# Altium schematic sheet PCB_RGBlimp-Q.schdoc
size 302 x 215 mm; Name: A_A4; Symbol: A_A4; Device: A_A4; @Project Name: RGBlimp-Q Control Unit; REV: 1.1; Date: 2023-12-02; Sheet: 1/1; Draw By: Hao Cheng; Company: PKU; Convert to PCB: yes; Add into BOM: yes
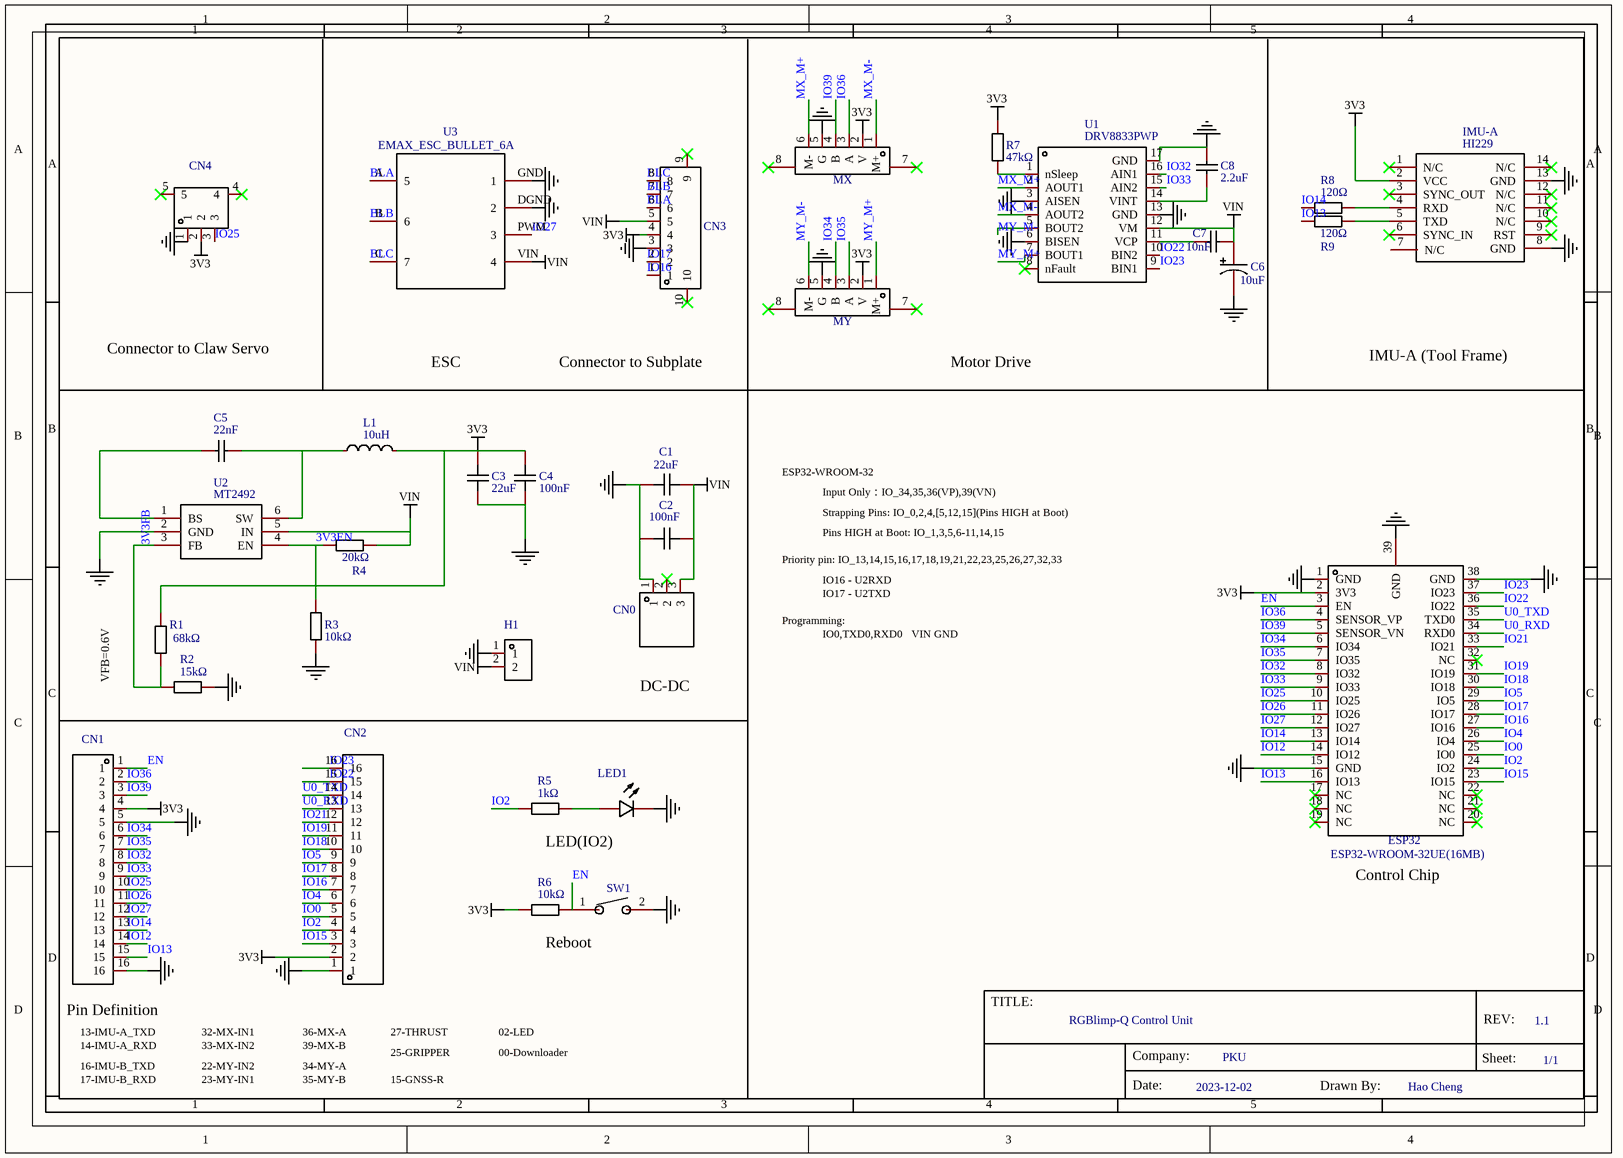
[diagram p0: PCB_RGBlimp-Q.schdoc]

## Parts
C1  22uF  [C0603]
C2  100nF  [C0603]
C3  22uF  [C0603]
C4  100nF  [C0603]
C5  22nF  [C0603]
C6  10uF  [CAP-SMD_L3.2-W1.6]
C7  10nF  [C0603]
C8  2.2uF  [C0603]
CN0  S3B-XH-A (LF)(SN)  [CONN-TH_S3B-XH-A-LF-SN-RGBLIMP]  (value not drawn)
CN1  A2005WV-16P  [HDR-TH_16P-P2.00-V-M]  (value not drawn)
CN2  A2005WV-16P  [HDR-TH_16P-P2.00-V-M]  (value not drawn)
CN3  AFC12-S08CCC-00  [CONN-SMD_8P-P1.25-V-M_AFC12-S08CCC-00]  (value not drawn)
CN4  AFC12-S03CCC-00  [CONN-SMD_AFC12-S03CCC-00]  (value not drawn)
ESP32  ESP32-WROOM-32UE(16MB)  [WIFI-SMD_ESP32-WROOM-32UE]
H1  A2005WV-2P_C2879963  [HDR-TH_2P-P2.00-V-M]  (value not drawn)
IMU-A  HI229  [HI229]
L1  10uH  [IND-SMD_L6.0-W6.0_SWPA6045S]
LED1  FC-DA1608BK-470H10  [LED0603-RD]  (value not drawn)
MX  KH-FG0.5-H2.0-6PIN  [FPC-SMD_KH-FG0.5-H2.0-6PIN]  (value not drawn)
MY  KH-FG0.5-H2.0-6PIN  [FPC-SMD_KH-FG0.5-H2.0-6PIN]  (value not drawn)
R1  68kΩ  [R0603]
R2  15kΩ  [R0603]
R3  10kΩ  [R0603]
R4  20kΩ  [R0603]
R5  1kΩ  [R0603]
R6  10kΩ  [R0603]
R7  47kΩ  [R0603]
R8  120Ω  [R0603]
R9  120Ω  [R0603]
SW1  TSA343G00D-250J2  [SW-SMD_L4.0-W2.9-P4.15-EH]  (value not drawn)
U1  DRV8833PWP  [TSSOP-16_L5.0-W4.4-P0.65-LS6.4-BL-EP]
U2  MT2492  [SOT-23-6_L2.9-W1.6-P0.95-LS2.8-BR]
U3  EMAX_ESC_BULLET_6A  [EMAX_ESC_BULLET_6A]

## Nets
3V3: C3.1 C4.1 CN1.4 CN2.2 CN3.4 CN4.2 ESP32.2(3V3) IMU-A.2(VCC) L1.2 MX.2(V) MY.2(V) R1.1 R6.1 R7.1
GND: C1.1 C2.1 C3.2 C4.2 C6.2 C8.1 CN0.1 CN1.5 CN1.16 CN2.1 CN3.3 CN4.1 ESP32.1(GND) ESP32.15(GND) ESP32.38(GND) ESP32.39(GND) H1.1 IMU-A.8(GND) IMU-A.13(GND) LED1.1(-) MX.5(G) MY.5(G) R2.2 R3.2 SW1.2 U1.3(AISEN) U1.6(BISEN) U1.13(GND) U1.17(GND) U2.2(GND) U3.DGND(2) U3.GND(1)
VIN: C1.2 C2.2 C6.1 C7.2 CN0.3 CN3.5 H1.2 R4.2 U1.12(VM) U2.5(IN) U3.VIN(4)
3V3EN: R3.1 R4.1 U2.4(EN)
3V3FB: R1.2 R2.1 U2.3(FB)
BLA: CN3.6 U3.A(5)
BLB: CN3.7 U3.B(6)
BLC: CN3.8 U3.C(7)
EN: CN1.1 ESP32.3(EN) R6.2 SW1.1
IO0: CN2.5 ESP32.25(IO0)
IO2: CN2.4 ESP32.24(IO2) R5.1
IO4: CN2.6 ESP32.26(IO4)
IO5: CN2.9 ESP32.29(IO5)
IO12: CN1.14 ESP32.14(IO12)
IO13: CN1.15 ESP32.16(IO13) R9.1
IO14: CN1.13 ESP32.13(IO14) R8.1
IO15: CN2.3 ESP32.23(IO15)
IO16: CN2.7 CN3.1 ESP32.27(IO16)
IO17: CN2.8 CN3.2 ESP32.28(IO17)
IO18: CN2.10 ESP32.30(IO18)
IO19: CN2.11 ESP32.31(IO19)
IO21: CN2.12 ESP32.33(IO21)
IO22: CN2.15 ESP32.36(IO22) U1.10(BIN2)
IO23: CN2.16 ESP32.37(IO23) U1.9(BIN1)
IO25: CN1.10 CN4.3 ESP32.10(IO25)
IO26: CN1.11 ESP32.11(IO26)
IO27: CN1.12 ESP32.12(IO27) U3.PWM(3)
IO32: CN1.8 ESP32.8(IO32) U1.16(AIN1)
IO33: CN1.9 ESP32.9(IO33) U1.15(AIN2)
IO34: CN1.6 ESP32.6(IO34) MY.4(B)
IO35: CN1.7 ESP32.7(IO35) MY.3(A)
IO36: CN1.2 ESP32.4(SENSOR_VP) MX.3(A)
IO39: CN1.3 ESP32.5(SENSOR_VN) MX.4(B)
MX_M+: MX.6(M-) U1.2(AOUT1)
MX_M-: MX.1(M+) U1.4(AOUT2)
MY_M+: MY.1(M+) U1.7(BOUT1)
MY_M-: MY.6(M-) U1.5(BOUT2)
U0_RXD: CN2.13 ESP32.34(RXD0)
U0_TXD: CN2.14 ESP32.35(TXD0)
NetC5_1: C5.1 U2.1(BS)
NetC5_2: C5.2 L1.1 U2.6(SW)
NetC7_1: C7.1 U1.11(VCP)
NetC8_2: C8.2 U1.14(VINT)
NetIMU-A_4: IMU-A.4(RXD) R8.2
NetIMU-A_5: IMU-A.5(TXD) R9.2
NetLED1_2: LED1.2(+) R5.2
NetR7_2: R7.2 U1.1(nSleep)

Not connected (* = marked no-connect by the designer): CN0 2*; CN3 9* 10*; CN4 4* 5*; ESP32 17(NC)* 18(NC)* 19(NC)* 20(NC)* 21(NC)* 22(NC)* 32(NC)*; IMU-A 1(N/C)* 3(SYNC_OUT)* 6(SYNC_IN)* 7(N/C) 9(RST)* 10(N/C)* 11(N/C)* 12(N/C)* 14(N/C)*; MX 7* 8*; MY 7* 8*; U1 8(nFault)*

## Notes on the sheet
- Connector to Claw Servo
- ESC
- Connector to Subplate
- Motor Drive
- IMU-A (Tool Frame)
- ESP32-WROOM-32
- Input Only：IO_34,35,36(VP),39(VN)
- Priority pin: IO_13,14,15,16,17,18,19,21,22,23,25,26,27,32,33
- Strapping Pins: IO_0,2,4,[5,12,15](Pins HIGH at Boot)
- Pins HIGH at Boot: IO_1,3,5,6-11,14,15
- Programming:
- IO16 - U2RXD
- IO17 - U2TXD
- IO0,TXD0,RXD0   VIN GND
- VFB=0.6V
- DC-DC
- LED(IO2)
- (near ESP32) Control Chip
- Reboot
- (near CN1) Pin Definition
- 13-IMU-A_TXD
- 32-MX-IN1
- 36-MX-A
- 27-THRUST
- 02-LED
- 14-IMU-A_RXD
- 17-IMU-B_RXD
- 16-IMU-B_TXD
- 22-MY-IN2
- 23-MY-IN1
- 33-MX-IN2
- 39-MX-B
- 35-MY-B
- 34-MY-A
- 25-GRIPPER
- 15-GNSS-R
- 00-Downloader
- 1
- 2
- 3
- 4
- 5
- A
- B
- C
- D
- TITLE:
- RGBlimp-Q Control Unit
- REV:
- 1.1
- Date:
- Company:
- 2023-12-02
- PKU
- Drawn By:
- Hao Cheng
- Sheet:
- 1/1

## Library data of the parts
C1 C3 = 22uF: Manufacturer: SAMSUNG(三星); Manufacturer Part: CL10A226MQ8NRNC; Convert to PCB: yes; Name: 22uF; Symbol: 22uF; Device: 22uF; Supplier: LCSC; Supplier Part: C59461; JLCPCB Part Class: Basic Part; link: https://so.szlcsc.com/global.html?k=C59461&amp;ref=editor; Add into BOM: yes; Origin Footprint: C0603
C2 C4 = 100nF: Manufacturer: YAGEO(国巨); Manufacturer Part: CC0603KRX7R9BB104; Convert to PCB: yes; Name: 100nF; Symbol: 100nF; Device: 100nF; Supplier: LCSC; Supplier Part: C14663; JLCPCB Part Class: Basic Part; link: https://so.szlcsc.com/global.html?k=C14663&amp;ref=editor; Add into BOM: yes; Origin Footprint: C0603
C5 = 22nF: Manufacturer: FH(风华); Manufacturer Part: 0603B223K500NT; Convert to PCB: yes; Name: 22nF; Symbol: 22nF; Device: 22nF; Supplier: LCSC; Supplier Part: C77571; JLCPCB Part Class: Extended Part; link: https://so.szlcsc.com/global.html?k=C77571&amp;ref=editor; Add into BOM: yes; Origin Footprint: C0603
C6 = 10uF: Manufacturer: TORCH(火炬); Manufacturer Part: CA45-A-16V-10μF-K; Convert to PCB: yes; Name: 10uF; Symbol: 10uF; Device: 10uF; Supplier: LCSC; Supplier Part: C185774; JLCPCB Part Class: Extended Part; Add into BOM: yes; Origin Footprint: CAP-SMD_L3.2-W1.6
C7 = 10nF: Manufacturer Part: GRM188R71H103KA01D; Manufacturer: muRata(村田); Convert to PCB: yes; Name: 10nF; Symbol: 10nF; Device: 10nF; Supplier: LCSC; Supplier Part: C77053; JLCPCB Part Class: Extended Part; link: https://so.szlcsc.com/global.html?k=C77053&amp;ref=editor; Add into BOM: yes; Origin Footprint: C0603
C8 = 2.2uF: Manufacturer Part: CL10A225KO8NNNC; Manufacturer: SAMSUNG(三星); Convert to PCB: yes; Name: 2.2uF; Symbol: 2.2uF; Device: 2.2uF; Supplier: LCSC; Supplier Part: C23630; JLCPCB Part Class: Basic Part; link: https://so.szlcsc.com/global.html?k=C23630&amp;ref=editor; Add into BOM: yes; Origin Footprint: C0603
CN0 = S3B-XH-A (LF)(SN): Manufacturer: JST; Convert to PCB: yes; Name: S3B-XH-A (LF)(SN); Symbol: S3B-XH-A (LF)(SN); Device: S3B-XH-A (LF)(SN); Supplier: LCSC; Supplier Part: C157928; Manufacturer Part: S3B-XH-A(LF)(SN); JLCPCB Part Class: Extended Part; link: https://so.szlcsc.com/global.html?k=C157928&amp;ref=editor; Add into BOM: yes; Origin Footprint: CONN-TH_S3B-XH-A-LF-SN-RGBLIMP
CN1 CN2 = A2005WV-16P: Manufacturer: Changjiang Connectors; Convert to PCB: yes; Name: A2005WV-16P; Symbol: A2005WV-16P; Device: A2005WV-16P; Supplier: LCSC; Supplier Part: C225268; Manufacturer Part: A2005WV-16P; JLCPCB Part Class: Extended Part; Add into BOM: yes; Origin Footprint: HDR-TH_16P-P2.00-V-M
CN3 = AFC12-S08CCC-00: Manufacturer: JS(钜硕电子); Convert to PCB: yes; Name: AFC12-S08CCC-00; Symbol: AFC12-S08CCC-00; Device: AFC12-S08CCC-00; Supplier: LCSC; Supplier Part: C395349; Manufacturer Part: AFC12-S08CCC-00; JLCPCB Part Class: Extended Part; link: https://so.szlcsc.com/global.html?k=C395349&amp;ref=editor; Add into BOM: yes; Origin Footprint: CONN-SMD_8P-P1.25-V-M_AFC12-S08CCC-00
CN4 = AFC12-S03CCC-00: Manufacturer: JS(钜硕电子); Convert to PCB: yes; Name: AFC12-S03CCC-00; Symbol: AFC12-S03CCC-00; Device: AFC12-S03CCC-00; Supplier: LCSC; Supplier Part: C395344; Manufacturer Part: AFC12-S03CCC-00; JLCPCB Part Class: Extended Part; Add into BOM: yes; Origin Footprint: CONN-SMD_AFC12-S03CCC-00
ESP32 = ESP32-WROOM-32UE(16MB): Manufacturer: ESPRESSIF(乐鑫); Manufacturer Part: ESP32-WROOM-32UE-N16; Convert to PCB: yes; Name: ESP32-WROOM-32UE(16MB); Symbol: ESP32-WROOM-32UE(16MB); Device: ESP32-WROOM-32UE(16MB); Supplier: LCSC; Supplier Part: C701346; JLCPCB Part Class: Extended Part; link: https://so.szlcsc.com/global.html?k=C701346&amp;ref=editor; Add into BOM: yes; Origin Footprint: WIFI-SMD_ESP32-WROOM-32UE
H1 = A2005WV-2P_C2879963: Manufacturer: CJT(长江连接器); Convert to PCB: yes; Name: A2005WV-2P_C2879963; Symbol: A2005WV-2P_C2879963; Device: A2005WV-2P_C2879963; Supplier: LCSC; Supplier Part: C2879963; Manufacturer Part: A2005WV-2P; JLCPCB Part Class: Extended Part; link: https://so.szlcsc.com/global.html?k=C2879963&amp;ref=editor; Add into BOM: yes; Origin Footprint: HDR-TH_2P-P2.00-V-M
IMU-A = HI229: Convert to PCB: yes; Name: HI229; Symbol: HI229; Device: HI229; Add into BOM: yes; Origin Footprint: HI229
L1 = 10uH: Manufacturer: Sunlord; Manufacturer Part: SWPA6045S100MT; Convert to PCB: yes; Name: 10uH; Symbol: 10uH; Device: 10uH; Supplier: LCSC; Supplier Part: C79272; Add into BOM: yes; Origin Footprint: IND-SMD_L6.0-W6.0_SWPA6045S
LED1 = FC-DA1608BK-470H10: Manufacturer: 国星光电; Manufacturer Part: NCD0603B1; Convert to PCB: yes; Name: FC-DA1608BK-470H10; Symbol: FC-DA1608BK-470H10; Device: FC-DA1608BK-470H10; Supplier: LCSC; Supplier Part: C84266; JLCPCB Part Class: Extended Part; Add into BOM: yes; Origin Footprint: LED0603-RD
MX MY = KH-FG0.5-H2.0-6PIN: Manufacturer: Shenzhen Kinghelm Elec; Convert to PCB: yes; Name: KH-FG0.5-H2.0-6PIN; Symbol: KH-FG0.5-H2.0-6PIN; Device: KH-FG0.5-H2.0-6PIN; Supplier: LCSC; Supplier Part: C709363; Manufacturer Part: KH-FG0.5-H2.0-6PIN; JLCPCB Part Class: Extended Part; Add into BOM: yes; Origin Footprint: FPC-SMD_KH-FG0.5-H2.0-6PIN
R1 = 68kΩ: Manufacturer: UNI-ROYAL(厚声); Manufacturer Part: 0603WAF6802T5E; Convert to PCB: yes; Name: 68kΩ; Symbol: 68kΩ; Device: 68kΩ; Supplier: LCSC; Supplier Part: C23231; JLCPCB Part Class: Basic Part; link: https://so.szlcsc.com/global.html?k=C23231&amp;ref=editor; Add into BOM: yes; Origin Footprint: R0603
R2 = 15kΩ: Manufacturer: UNI-ROYAL(厚声); Manufacturer Part: 0603WAF1502T5E; Convert to PCB: yes; Name: 15kΩ; Symbol: 15kΩ; Device: 15kΩ; Supplier: LCSC; Supplier Part: C22809; JLCPCB Part Class: Basic Part; link: https://so.szlcsc.com/global.html?k=C22809&amp;ref=editor; Add into BOM: yes; Origin Footprint: R0603
R3 R6 = 10kΩ: Manufacturer: UNI-ROYAL(厚声); Manufacturer Part: 0603WAF1002T5E; Convert to PCB: yes; Name: 10kΩ; Symbol: 10kΩ; Device: 10kΩ; Supplier: LCSC; Supplier Part: C25804; JLCPCB Part Class: Basic Part; link: https://so.szlcsc.com/global.html?k=C25804&amp;ref=editor; Add into BOM: yes; Origin Footprint: R0603
R4 = 20kΩ: Manufacturer: UNI-ROYAL(厚声); Manufacturer Part: 0603WAF2002T5E; Convert to PCB: yes; Name: 20kΩ; Symbol: 20kΩ; Device: 20kΩ; Supplier: LCSC; Supplier Part: C4184; JLCPCB Part Class: Basic Part; link: https://so.szlcsc.com/global.html?k=C4184&amp;ref=editor; Add into BOM: yes; Origin Footprint: R0603
R5 = 1kΩ: Manufacturer: UNI-ROYAL(厚声); Manufacturer Part: 0603WAF1001T5E; Convert to PCB: yes; Name: 1kΩ; Symbol: 1kΩ; Device: 1kΩ; Supplier: LCSC; Supplier Part: C21190; JLCPCB Part Class: Basic Part; link: https://so.szlcsc.com/global.html?k=C21190&amp;ref=editor; Add into BOM: yes; Origin Footprint: R0603
R7 = 47kΩ: Manufacturer: UNI-ROYAL(厚声); Manufacturer Part: 0603WAF4702T5E; Convert to PCB: yes; Name: 47kΩ; Symbol: 47kΩ; Device: 47kΩ; Supplier: LCSC; Supplier Part: C25819; JLCPCB Part Class: Basic Part; link: https://so.szlcsc.com/global.html?k=C25819&amp;ref=editor; Add into BOM: yes; Origin Footprint: R0603
R8 R9 = 120Ω: Manufacturer: UNI-ROYAL(厚声); Manufacturer Part: 0603WAF1200T5E; Convert to PCB: yes; Name: 120Ω; Symbol: 120Ω; Device: 120Ω; Supplier: LCSC; Supplier Part: C22787; JLCPCB Part Class: Basic Part; link: https://so.szlcsc.com/global.html?k=C22787&amp;ref=editor; Add into BOM: yes; Origin Footprint: R0603
SW1 = TSA343G00D-250J2: Manufacturer: BRIGHT; Convert to PCB: yes; Name: TSA343G00D-250J2; Symbol: TSA343G00D-250J2; Device: TSA343G00D-250J2; Supplier: LCSC; Supplier Part: C354947; Manufacturer Part: TSA343G00D-250J2; JLCPCB Part Class: Extended Part; Add into BOM: yes; Origin Footprint: SW-SMD_L4.0-W2.9-P4.15-EH
U1 = DRV8833PWP: Manufacturer: TI(德州仪器); Manufacturer Part: DRV8833PWPR; Convert to PCB: yes; Name: DRV8833PWP; Symbol: DRV8833PWP; Device: DRV8833PWP; Supplier: LCSC; Supplier Part: C50506; JLCPCB Part Class: Extended Part; link: https://so.szlcsc.com/global.html?k=C50506&amp;ref=editor; Add into BOM: yes; Origin Footprint: TSSOP-16_L5.0-W4.4-P0.65-LS6.4-BL-EP
U2 = MT2492: Manufacturer: AEROSEMI; Convert to PCB: yes; Name: MT2492; Symbol: MT2492; Device: MT2492; Supplier: LCSC; Manufacturer Part: MT2492; Supplier Part: C89358; JLCPCB Part Class: Extend; Add into BOM: yes; Origin Footprint: SOT-23-6_L2.9-W1.6-P0.95-LS2.8-BR
U3 = EMAX_ESC_BULLET_6A: Convert to PCB: yes; Name: EMAX_ESC_BULLET_6A; Symbol: EMAX_ESC_BULLET_6A; Device: EMAX_ESC_BULLET_6A; Add into BOM: yes; Origin Footprint: EMAX_ESC_BULLET_6A